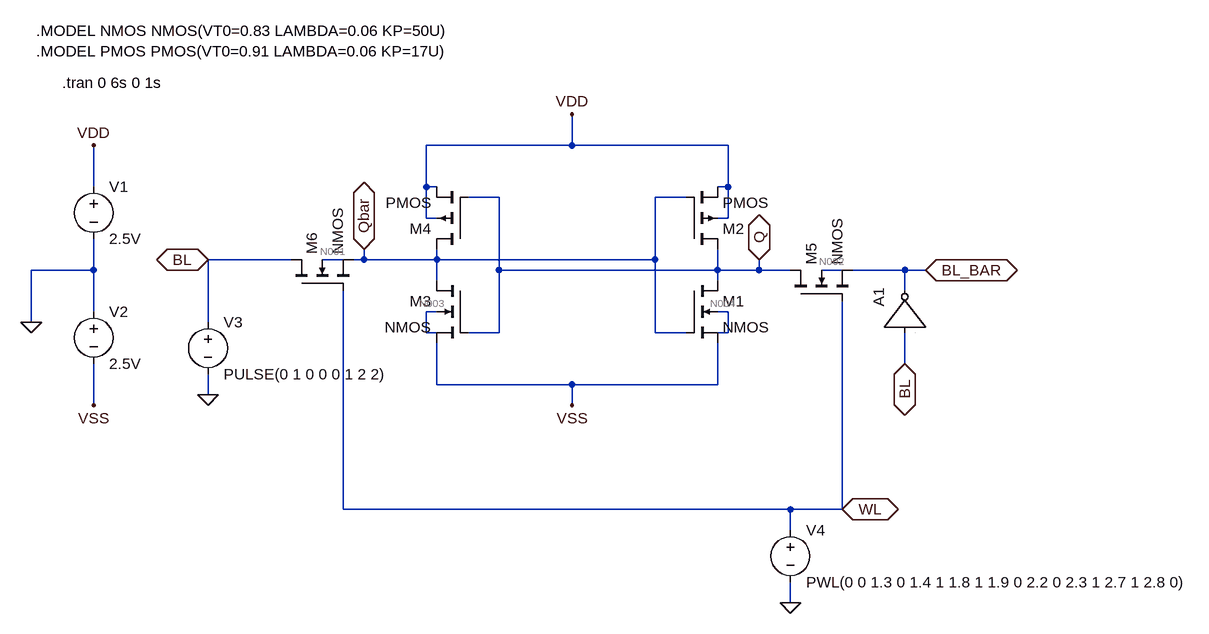
[diagram p0: schematic Writing.asc]
Writing.asc, the LTspice schematic file:
Version 4
SHEET 1 1580 708
WIRE 560 -16 560 -64
WIRE 560 -16 336 -16
WIRE 800 -16 560 -16
WIRE -176 48 -176 -16
WIRE 336 48 336 -16
WIRE 352 48 336 48
WIRE 800 48 800 -16
WIRE 800 48 784 48
WIRE 448 64 400 64
WIRE 736 64 688 64
WIRE 336 96 336 48
WIRE 352 96 336 96
WIRE 800 96 800 48
WIRE 800 96 784 96
WIRE 128 160 0 160
WIRE 208 160 176 160
WIRE 240 160 240 144
WIRE 240 160 224 160
WIRE 352 160 352 144
WIRE 352 160 240 160
WIRE 688 160 688 64
WIRE 688 160 352 160
WIRE -176 176 -176 128
WIRE -176 176 -272 176
WIRE 448 176 448 64
WIRE 784 176 784 144
WIRE 784 176 448 176
WIRE 848 176 848 160
WIRE 848 176 784 176
WIRE 896 176 848 176
WIRE 976 176 944 176
WIRE 1072 176 992 176
WIRE 1104 176 1072 176
WIRE 352 192 352 160
WIRE 784 192 784 176
WIRE 1072 208 1072 176
WIRE -176 240 -176 176
WIRE 352 240 336 240
WIRE 800 240 784 240
WIRE -272 256 -272 176
WIRE 0 256 0 160
WIRE 336 272 336 240
WIRE 352 272 336 272
WIRE 448 272 448 176
WIRE 448 272 400 272
WIRE 688 272 688 160
WIRE 736 272 688 272
WIRE 800 272 800 240
WIRE 800 272 784 272
WIRE 1072 320 1072 272
WIRE 352 352 352 288
WIRE 560 352 352 352
WIRE 784 352 784 288
WIRE 784 352 560 352
WIRE 0 368 0 336
WIRE -176 384 -176 320
WIRE 560 384 560 352
WIRE 208 544 208 208
WIRE 896 544 208 544
WIRE 976 544 976 224
WIRE 976 544 896 544
WIRE 896 576 896 544
WIRE 896 688 896 656
FLAG -272 256 0
FLAG -176 -16 VDD
FLAG 560 -64 VDD
FLAG -176 384 VSS
FLAG 560 384 VSS
FLAG 976 544 WL
IOPIN 976 544 BiDir
FLAG 0 160 BL
IOPIN 0 160 BiDir
FLAG 1104 176 BL_BAR
IOPIN 1104 176 BiDir
FLAG 0 368 0
FLAG 1072 320 BL
IOPIN 1072 320 BiDir
FLAG 896 688 0
FLAG 848 160 Q
IOPIN 848 160 BiDir
FLAG 240 144 Qbar
IOPIN 240 144 BiDir
SYMBOL nmos4 736 192 R0
SYMATTR InstName M1
SYMATTR Value2 l=5 w=15
SYMBOL pmos4 736 144 M180
SYMATTR InstName M2
SYMATTR Value2 l=5 w=15
SYMBOL voltage -176 32 R0
WINDOW 123 0 0 Left 2
WINDOW 39 0 0 Left 2
SYMATTR InstName V1
SYMATTR Value 2.5V
SYMBOL voltage -176 224 R0
WINDOW 123 0 0 Left 2
WINDOW 39 0 0 Left 2
SYMATTR InstName V2
SYMATTR Value 2.5V
SYMBOL nmos4 400 192 M0
SYMATTR InstName M3
SYMATTR Value2 l=5 w=15
SYMBOL pmos4 400 144 R180
SYMATTR InstName M4
SYMATTR Value2 l=5 w=15
SYMBOL nmos4 896 224 R270
SYMATTR InstName M5
SYMATTR Value2 l=5 w=60
SYMBOL nmos4 128 208 R270
SYMATTR InstName M6
SYMATTR Value2 l=5 w=60
SYMBOL voltage 0 240 R0
SYMATTR InstName V3
SYMATTR Value PULSE(0 1 0 0 0 1 2 2)
SYMBOL Digital\\inv 1008 272 R270
SYMATTR InstName A1
SYMBOL voltage 896 560 R0
SYMATTR InstName V4
SYMATTR Value PWL(0 0 1.3 0 1.4 1 1.8 1 1.9 0 2.2 0 2.3 1 2.7 1 2.8 0)
TEXT -264 -192 Left 2 !.MODEL NMOS NMOS(VT0=0.83 LAMBDA=0.06 KP=50U)\n.MODEL PMOS PMOS(VT0=0.91 LAMBDA=0.06 KP=17U)
TEXT -224 -112 Left 2 !.tran 0 6s 0 1s

The netlist it stands for:
* Writing.asc
M1 Q Qbar VSS N004 NMOS l=5 w=15
M2 Q Qbar VDD VDD PMOS l=5 w=15
V1 VDD 0 2.5V
V2 0 VSS 2.5V
M3 Qbar Q VSS N003 NMOS l=5 w=15
M4 Qbar Q VDD VDD PMOS l=5 w=15
M5 Q WL BL_BAR N002 NMOS l=5 w=60
M6 BL WL Qbar N001 NMOS l=5 w=60
V3 BL 0 PULSE(0 1 0 0 0 1 2 2)
A1 BL 0 0 0 0 BL_BAR 0 0 BUF
V4 WL 0 PWL(0 0 1.3 0 1.4 1 1.8 1 1.9 0 2.2 0 2.3 1 2.7 1 2.8 0)
.model NMOS NMOS
.model PMOS PMOS
.lib standard.mos
.MODEL NMOS NMOS(VT0=0.83 LAMBDA=0.06 KP=50U)
.MODEL PMOS PMOS(VT0=0.91 LAMBDA=0.06 KP=17U)
.tran 0 6s 0 1s
.backanno
.end

* Results of the author's LTspice run, read from the files saved beside the schematic
* Operating Point, zero values left out:
*   V(q) = 144.8 mV
*   V(qbar) = 144.8 mV
*   V(vss) = -2.5 V
*   V(n004) = -2.341 V
*   V(vdd) = 2.5 V
*   V(n003) = -2.341 V
*   V(bl_bar) = 1 V
*   V(n002) = 242.5 mV
*   V(n001) = 39.51 mV
*   Id(M4) = -286.2 µA
*   Ib(M4) = 2.365 pA
*   Is(M4) = 286.2 µA
*   Id(M2) = -286.2 µA
*   Ib(M2) = 2.365 pA
*   Is(M2) = 286.2 µA
*   Id(M5) = -1.38 pA
*   Is(M5) = 1.623 pA
*   Id(M3) = 286.2 µA
*   Ib(M3) = 2.346 pA
*   Is(M3) = -286.2 µA
*   Id(M1) = 286.2 µA
*   Ib(M1) = 2.348 pA
*   Is(M1) = -286.2 µA
*   I(V2) = -572.4 µA
*   I(V1) = -572.4 µA
*   I8(A1) = 1.623 pA
*   I6(A1) = -1.623 pA
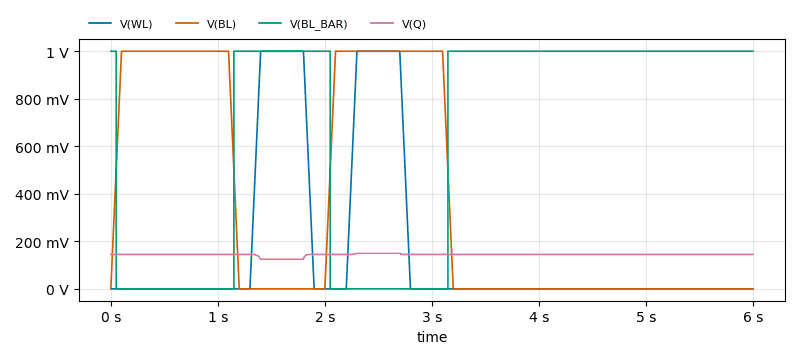
[diagram p1: Transient Analysis of Writing.asc, plotted from the saved traces]
* Transient Analysis, 1 run:
*   V(WL): min 0 V, max 1 V, average 166.7 mV, rms 396.1 mV, last 0 V
*   V(BL): min 0 V, max 1 V, average 366.7 mV, rms 596.6 mV, last 0 V
*   V(BL_BAR): min 0 V, max 1 V, average 633.3 mV, rms 795.8 mV, last 1 V
*   V(Q): min 124.7 mV, max 149.8 mV, average 143.7 mV, rms 143.8 mV, last 144.8 mV